# EAGLE schematic Motherboard V1.1 (EAGLE 9.6.2)

## Sheet 1 of 2
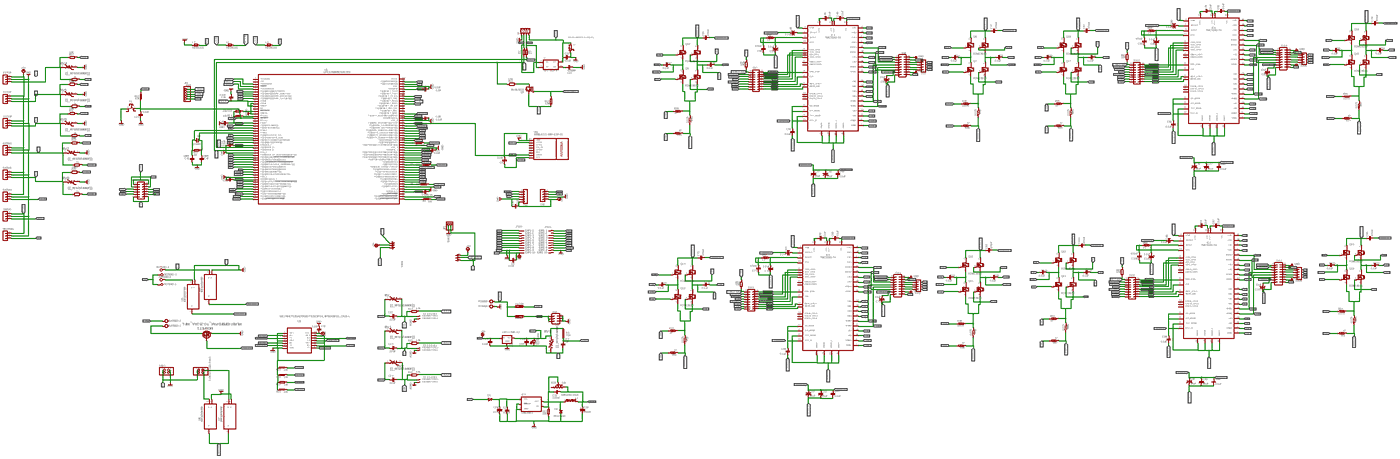
[diagram p0: schematic, sheet 1, overview]
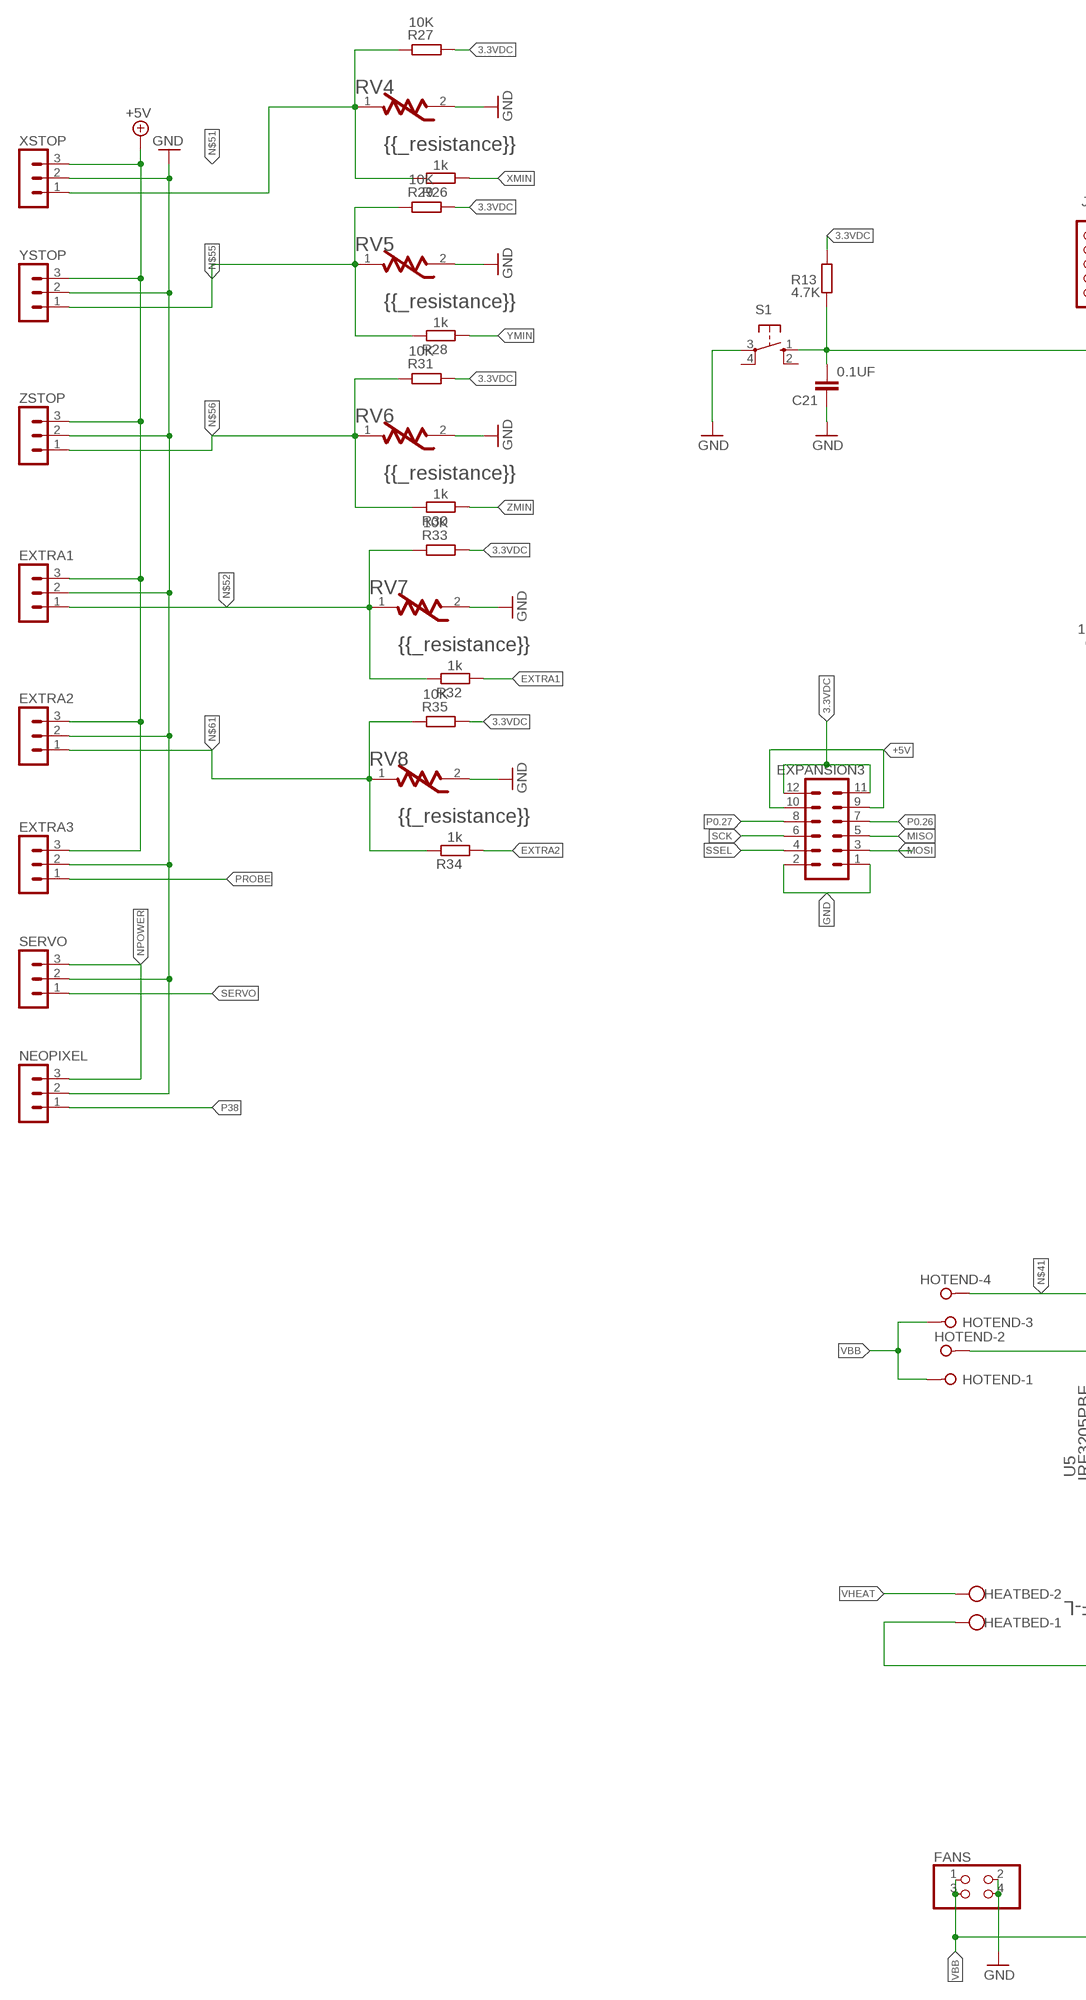
[diagram p1: schematic, sheet 1, part 1 of 4]
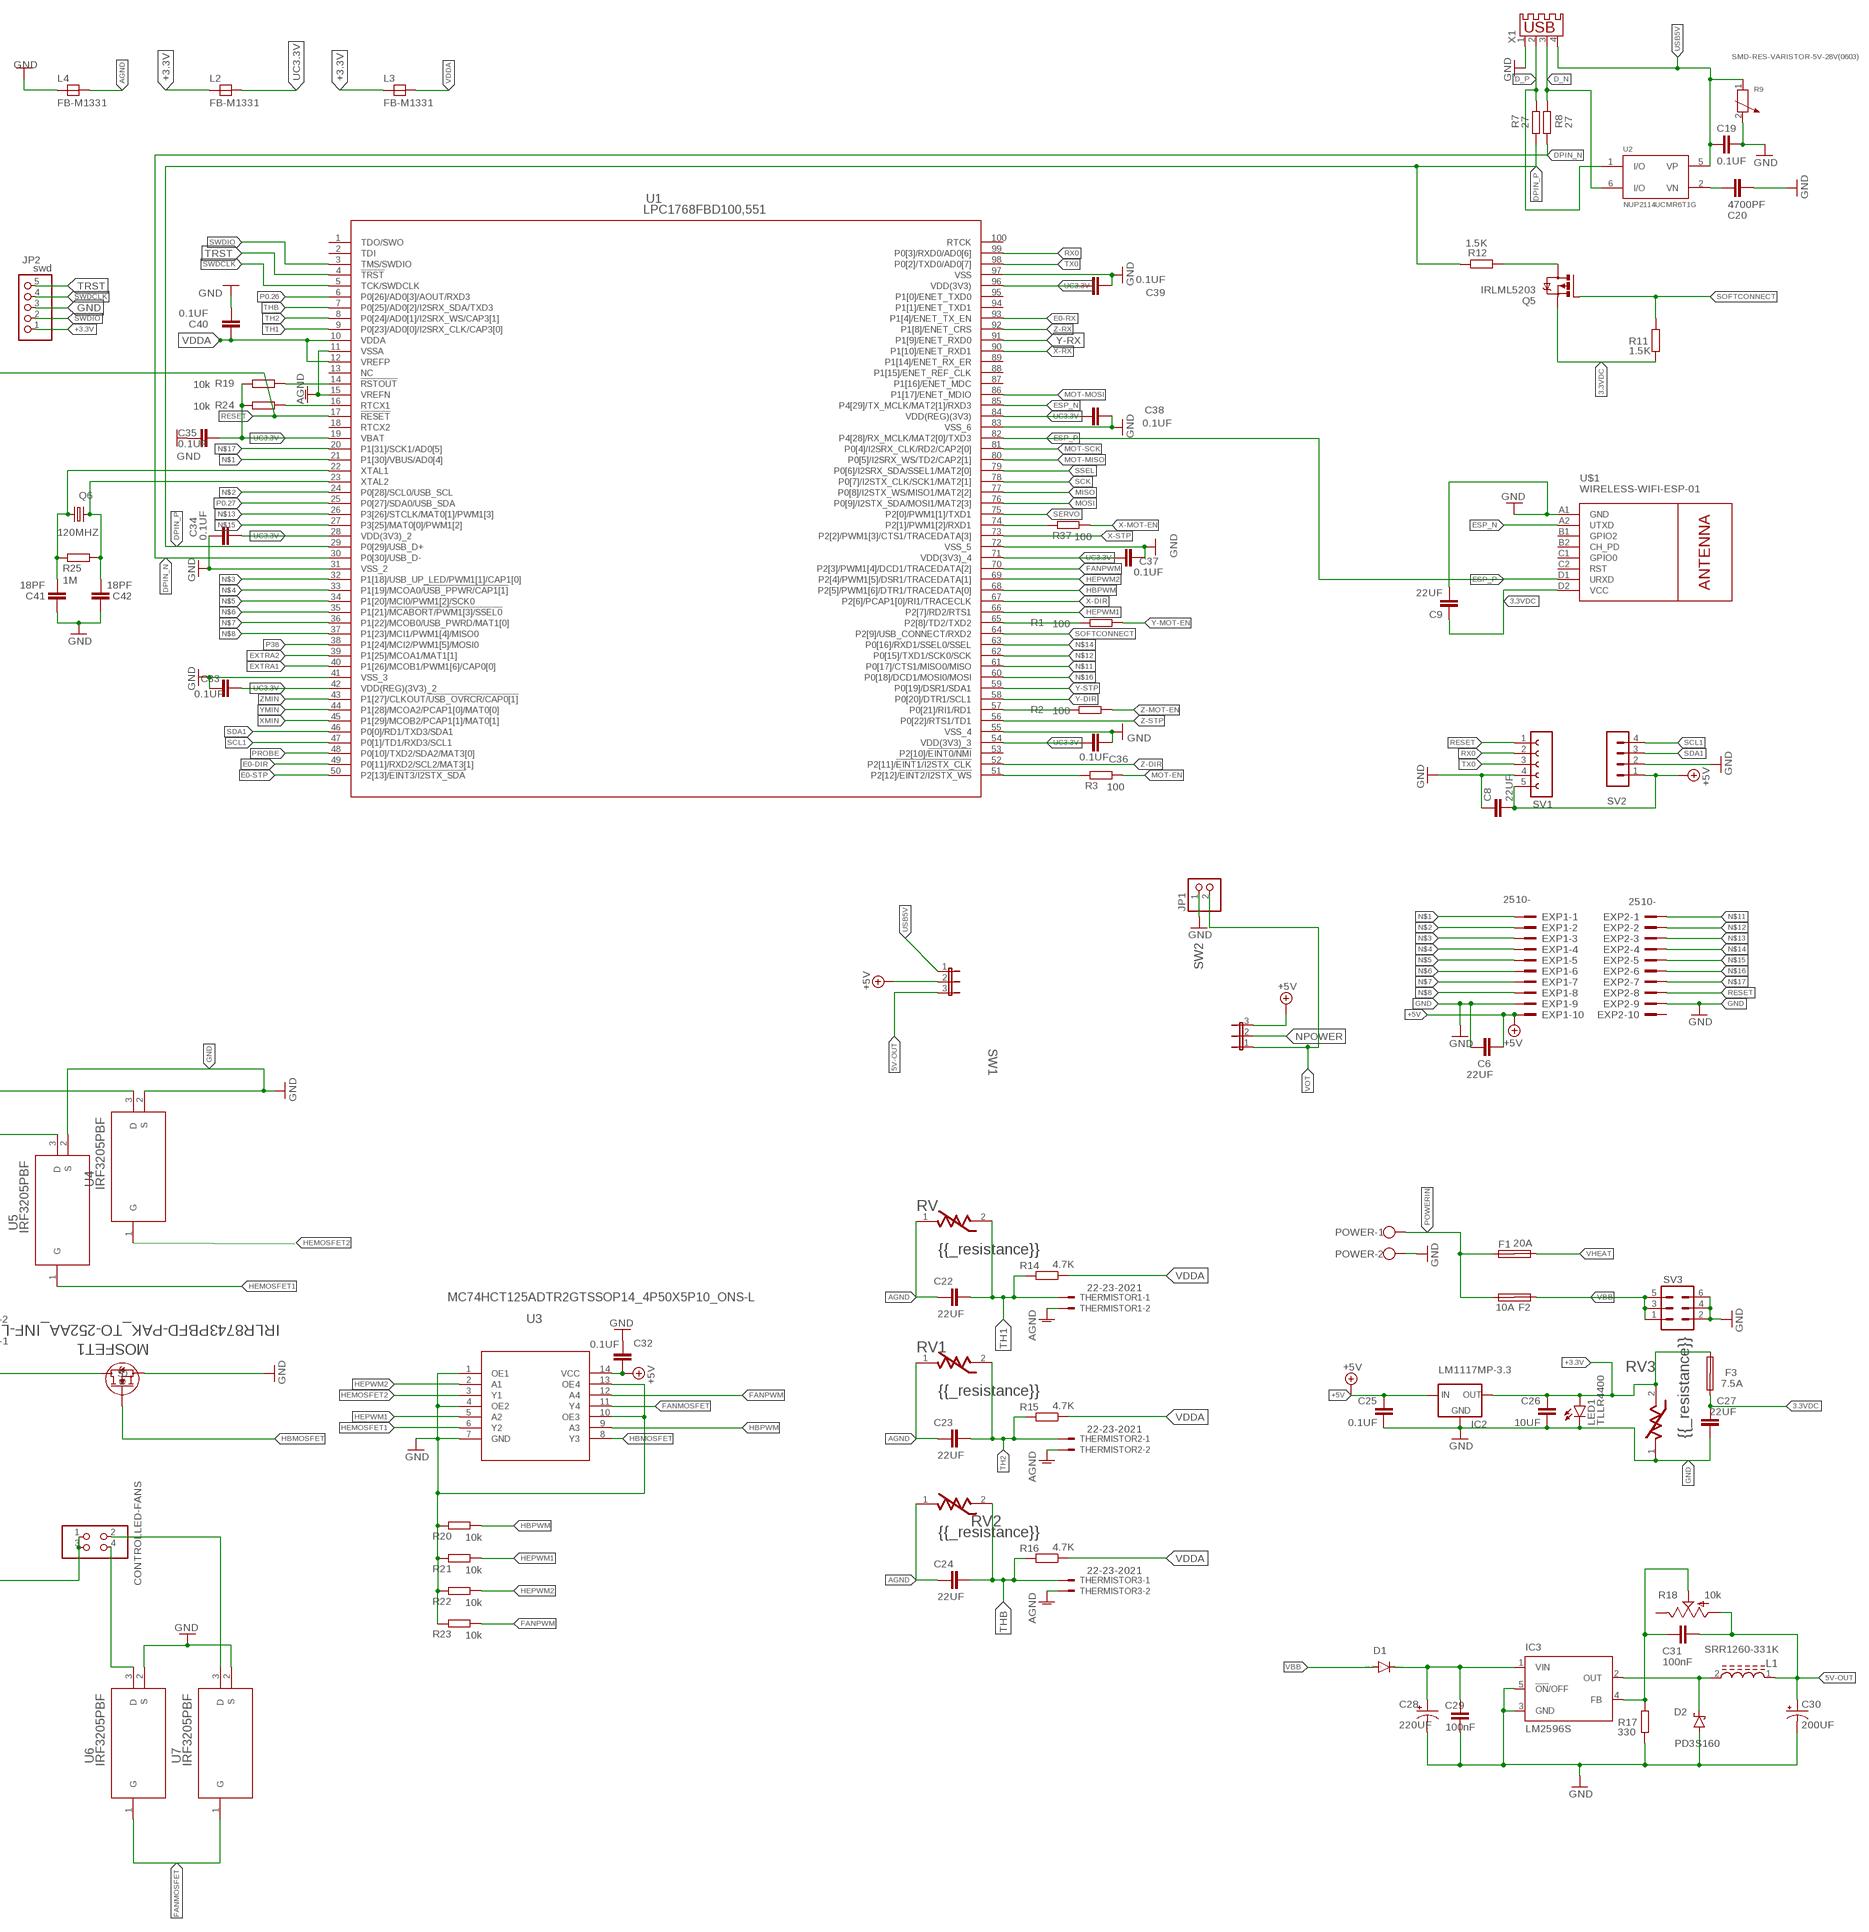
[diagram p2: schematic, sheet 1, part 2 of 4]
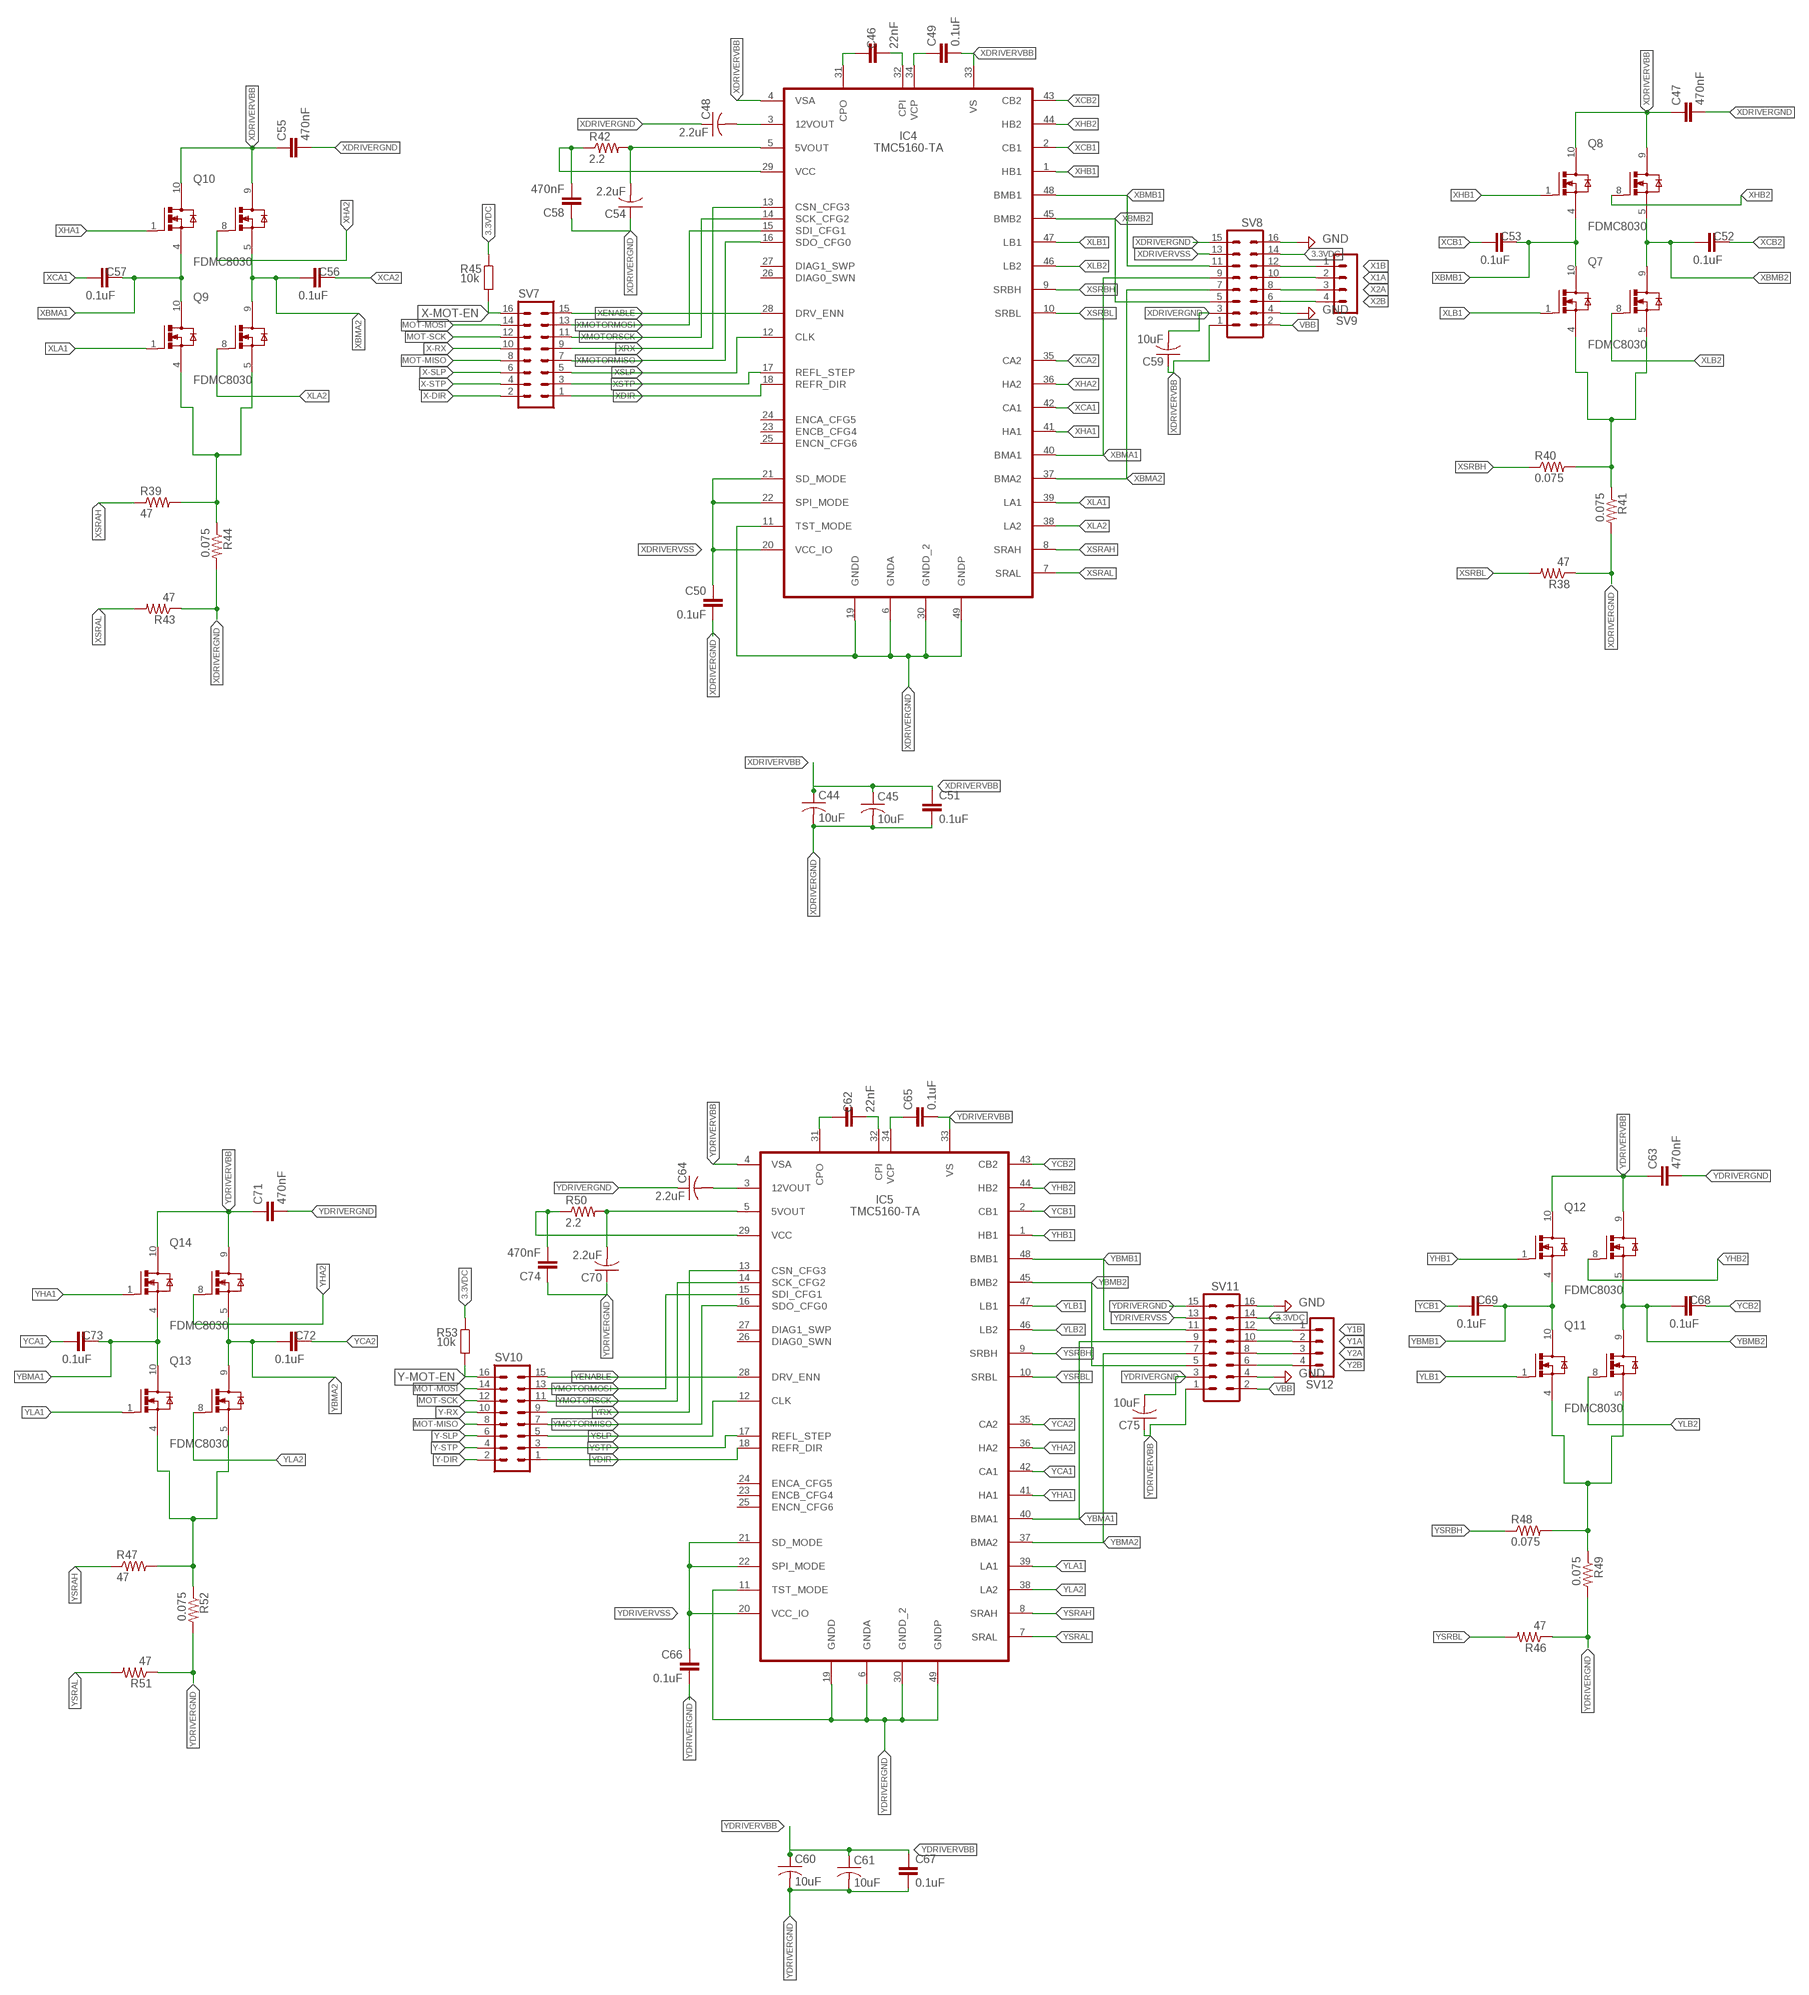
[diagram p3: schematic, sheet 1, part 3 of 4]
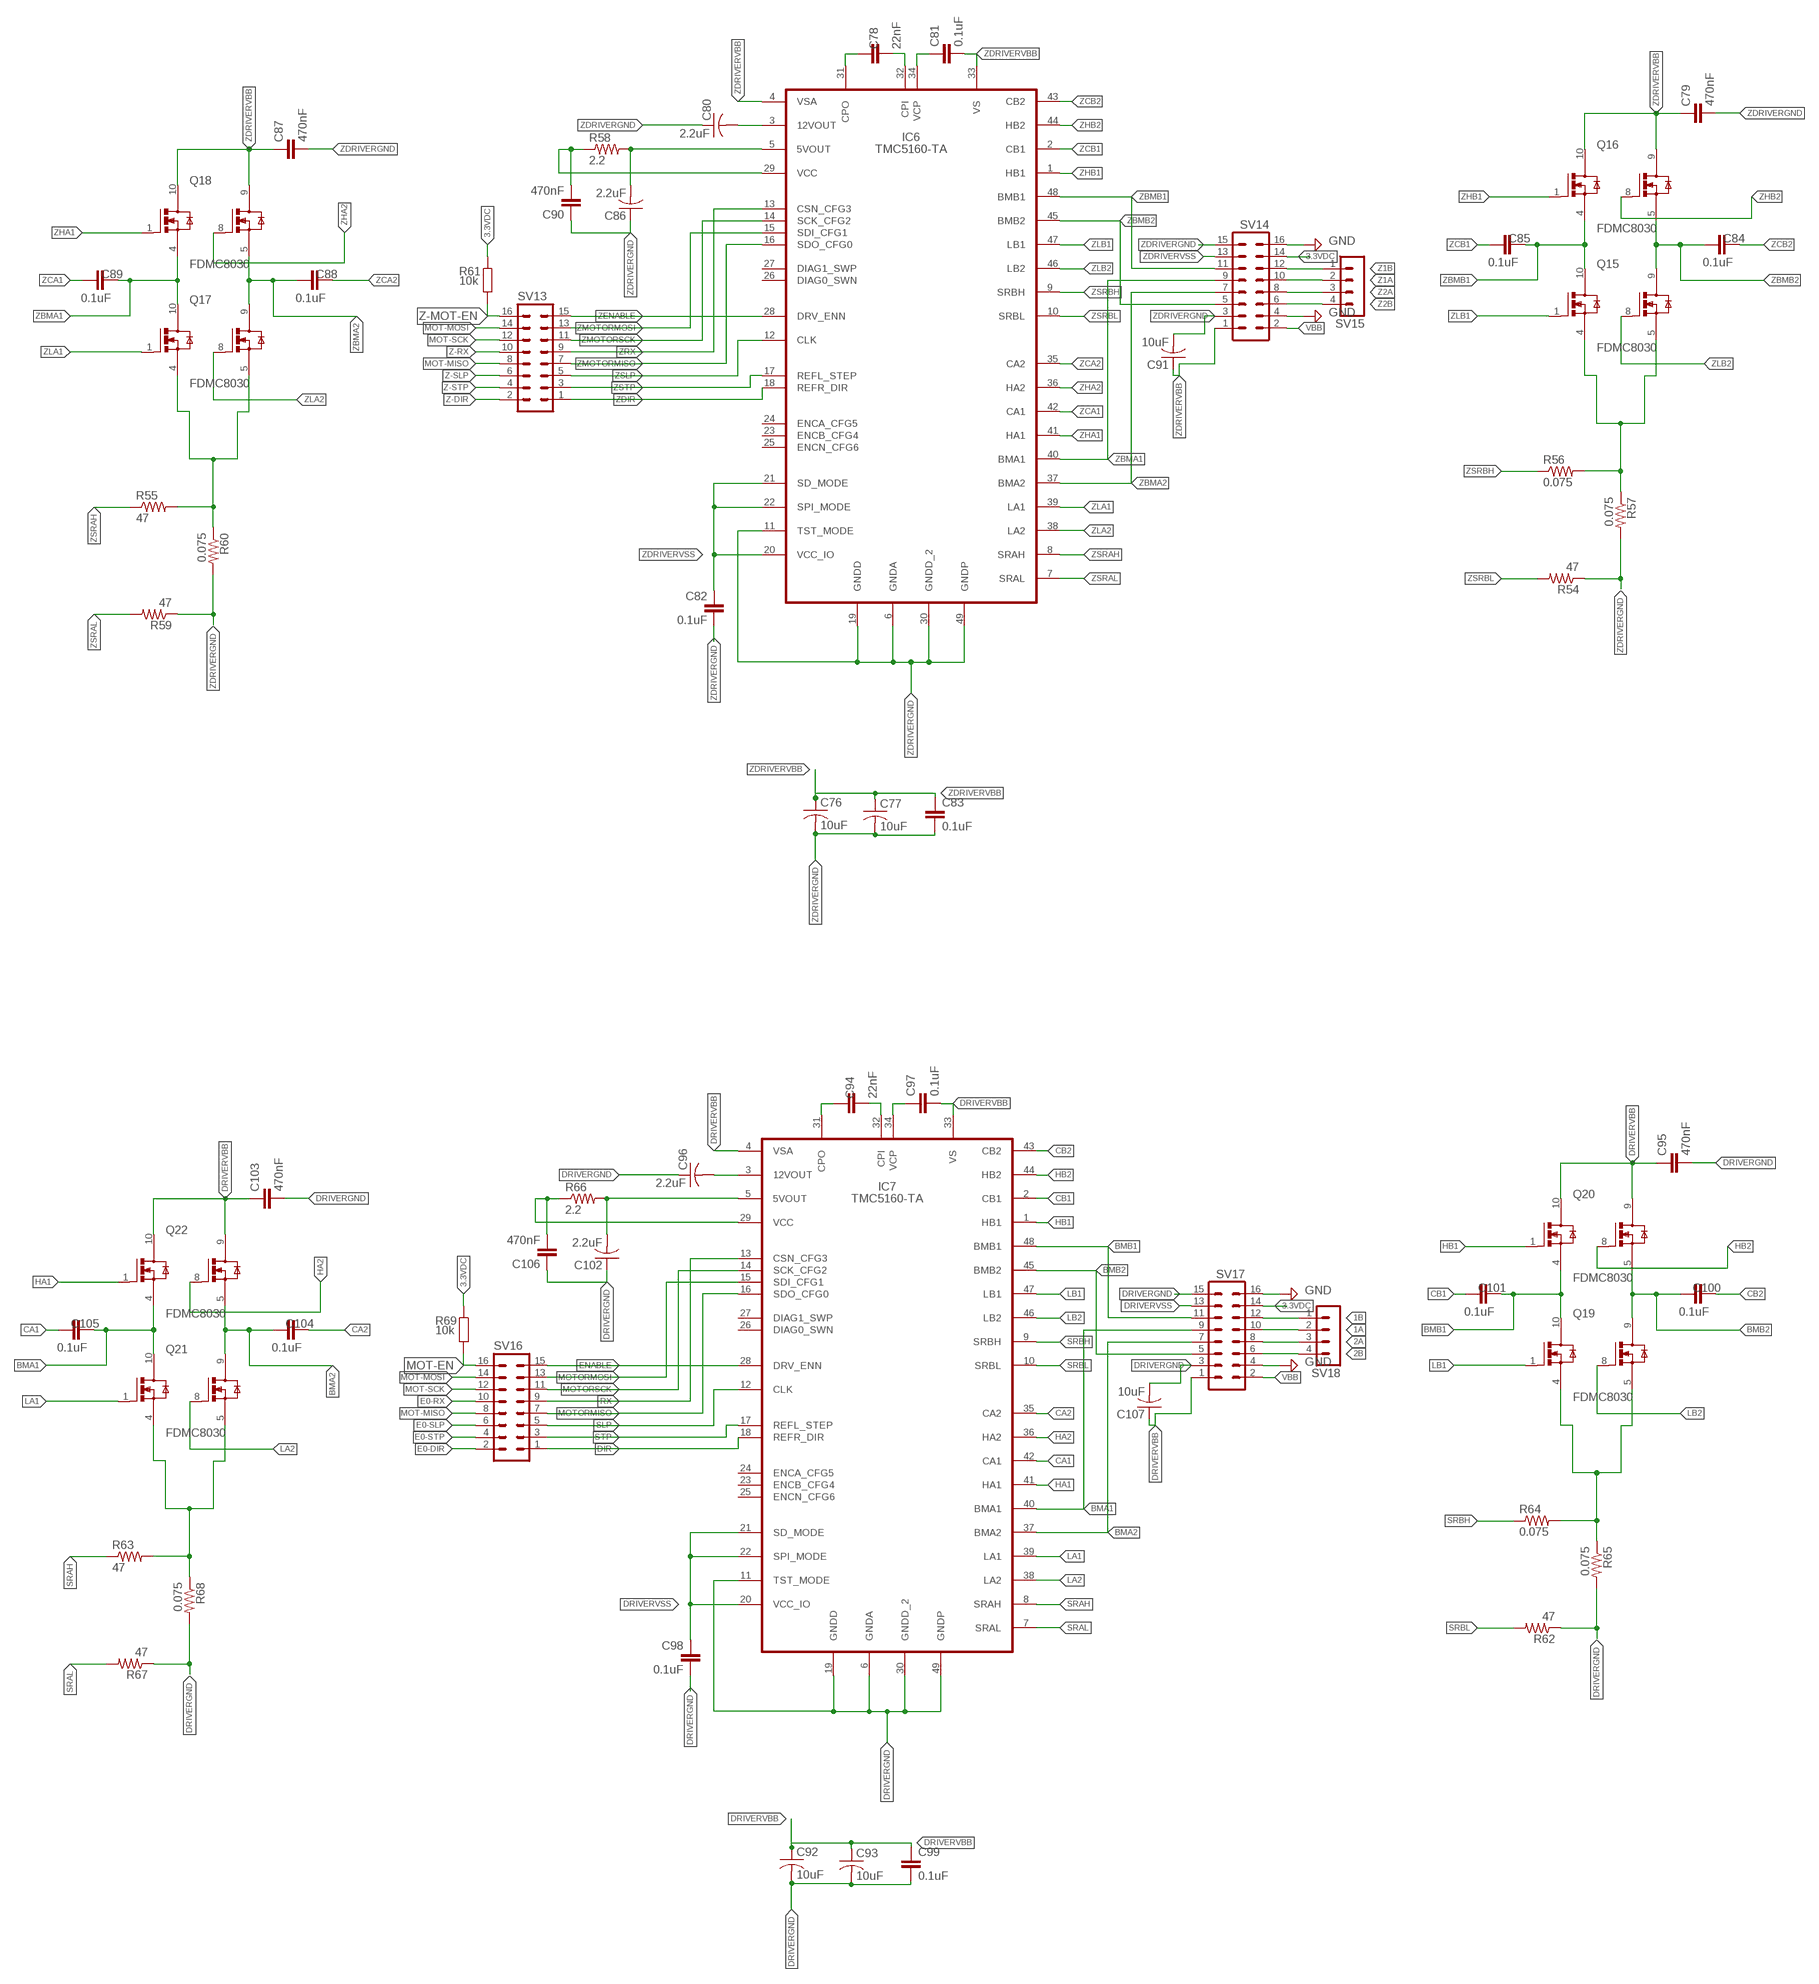
[diagram p4: schematic, sheet 1, part 4 of 4]

### Parts
C6  22UF  C-EUC0805  [C0805]
C8  22UF  C-EUC0805  [C0805]
C9  22UF  C-EUC0805  [C0805]
C19  0.1UF  C-EUC0805  [C0805]
C20  4700PF  C-EUC0805  [C0805]
C21  0.1UF  C-EUC0805  [C0805]
C22  22UF  C-EUC0805  [C0805]
C23  22UF  C-EUC0805  [C0805]
C24  22UF  C-EUC0805  [C0805]
C25  0.1UF  C-EUC0805  [C0805]
C26  10UF  C-EUC0805  [C0805]
C27  22UF  C-EUC0805  [C0805]
C28  220UF  CPOL-USE5-10.5  [E5-10,5]
C29  100nF  C-EUC0805  [C0805]
C30  200UF  CPOL-USE5-10.5  [E5-10,5]
C31  100nF  C-EUC0805  [C0805]
C32  0.1UF  C-EUC0805  [C0805]
C33  0.1UF  C-EUC0805  [C0805]
C34  0.1UF  C-EUC0805  [C0805]
C35  0.1UF  C-EUC0805  [C0805]
C36  0.1UF  C-EUC0805  [C0805]
C37  0.1UF  C-EUC0805  [C0805]
C38  0.1UF  C-EUC0805  [C0805]
C39  0.1UF  C-EUC0805  [C0805]
C40  0.1UF  C-EUC0805  [C0805]
C41  18PF  C-EUC0805  [C0805]
C42  18PF  C-EUC0805  [C0805]
C44  10uF  C-USC0805  [C0805]
C45  10uF  C-USC0805  [C0805]
C46  22nF  22NF/22,000PF-0603-50V-10%  [0603]
C47  470nF  470NF-0402-16V-10%  [0402]
C48  2.2uF  C-USC0402  [C0402]
C49  0.1uF  0.1UF-0402-16V-10%  [0402]
C50  0.1uF  0.1UF-0402-16V-10%  [0402]
C51  0.1uF  0.1UF-0402-16V-10%  [0402]
C52  0.1uF  0.1UF-0402-16V-10%  [0402]
C53  0.1uF  0.1UF-0402-16V-10%  [0402]
C54  2.2uF  C-USC0402  [C0402]
C55  470nF  470NF-0402-16V-10%  [0402]
C56  0.1uF  0.1UF-0402-16V-10%  [0402]
C57  0.1uF  0.1UF-0402-16V-10%  [0402]
C58  470nF  470NF-0402-16V-10%  [0402]
C59  10uF  C-USC0805  [C0805]
C60  10uF  C-USC0805  [C0805]
C61  10uF  C-USC0805  [C0805]
C62  22nF  22NF/22,000PF-0603-50V-10%  [0603]
C63  470nF  470NF-0402-16V-10%  [0402]
C64  2.2uF  C-USC0402  [C0402]
C65  0.1uF  0.1UF-0402-16V-10%  [0402]
C66  0.1uF  0.1UF-0402-16V-10%  [0402]
C67  0.1uF  0.1UF-0402-16V-10%  [0402]
C68  0.1uF  0.1UF-0402-16V-10%  [0402]
C69  0.1uF  0.1UF-0402-16V-10%  [0402]
C70  2.2uF  C-USC0402  [C0402]
C71  470nF  470NF-0402-16V-10%  [0402]
C72  0.1uF  0.1UF-0402-16V-10%  [0402]
C73  0.1uF  0.1UF-0402-16V-10%  [0402]
C74  470nF  470NF-0402-16V-10%  [0402]
C75  10uF  C-USC0805  [C0805]
C76  10uF  C-USC0805  [C0805]
C77  10uF  C-USC0805  [C0805]
C78  22nF  22NF/22,000PF-0603-50V-10%  [0603]
C79  470nF  470NF-0402-16V-10%  [0402]
C80  2.2uF  C-USC0402  [C0402]
C81  0.1uF  0.1UF-0402-16V-10%  [0402]
C82  0.1uF  0.1UF-0402-16V-10%  [0402]
C83  0.1uF  0.1UF-0402-16V-10%  [0402]
C84  0.1uF  0.1UF-0402-16V-10%  [0402]
C85  0.1uF  0.1UF-0402-16V-10%  [0402]
C86  2.2uF  C-USC0402  [C0402]
C87  470nF  470NF-0402-16V-10%  [0402]
C88  0.1uF  0.1UF-0402-16V-10%  [0402]
C89  0.1uF  0.1UF-0402-16V-10%  [0402]
C90  470nF  470NF-0402-16V-10%  [0402]
C91  10uF  C-USC0805  [C0805]
C92  10uF  C-USC0805  [C0805]
C93  10uF  C-USC0805  [C0805]
C94  22nF  22NF/22,000PF-0603-50V-10%  [0603]
C95  470nF  470NF-0402-16V-10%  [0402]
C96  2.2uF  C-USC0402  [C0402]
C97  0.1uF  0.1UF-0402-16V-10%  [0402]
C98  0.1uF  0.1UF-0402-16V-10%  [0402]
C99  0.1uF  0.1UF-0402-16V-10%  [0402]
C100  0.1uF  0.1UF-0402-16V-10%  [0402]
C101  0.1uF  0.1UF-0402-16V-10%  [0402]
C102  2.2uF  C-USC0402  [C0402]
C103  470nF  470NF-0402-16V-10%  [0402]
C104  0.1uF  0.1UF-0402-16V-10%  [0402]
C105  0.1uF  0.1UF-0402-16V-10%  [0402]
C106  470nF  470NF-0402-16V-10%  [0402]
C107  10uF  C-USC0805  [C0805]
CONTROLLED-FANS  PINHD-2X2  [2X02]
D1  DIODE-DO214AA  [DO214AA]
D2  PD3S160  [POWERDI323]
EXP1  2510-  [PAK100/2500-10]
EXP2  2510-  [PAK100/2500-10]
EXPANSION3  MA06-2  [MA06-2]
EXTRA1  MA03-1  [MA03-1]
EXTRA2  MA03-1  [MA03-1]
EXTRA3  MA03-1  [MA03-1]
F1  20A  SHK20Q  [SHK20Q]
F2  10A  SHK20Q  [SHK20Q]
F3  7.5A  SHK20Q  [SHK20Q]
FANS  PINHD-2X2  [2X02]
HEATBED  W237-102  [W237-102]
HOTEND  W237-04P  [W237-4P]
IC2  LM1117MP-3.3  [SOT223]
IC3  LM2596S  [TO263-5]
IC4  TMC5160-TA  [TQFP48-EP]
IC5  TMC5160-TA  [TQFP48-EP]
IC6  TMC5160-TA  [TQFP48-EP]
IC7  TMC5160-TA  [TQFP48-EP]
JP1  PINHD-1X2  [1X02]
JP2  swd  PINHD-1X5  [1X05]
L1  SRR1260-331K  [INDP125125X600N]
L2  FB-M1331  [M1331]
L3  FB-M1331  [M1331]
L4  FB-M1331  [M1331]
LED1  TLLR4400  [LED3MM]
MOSFET1  IRLR8743PBFD-PAK_TO-252AA_INF-L  [D-PAK_TO-252AA_INF-L]
NEOPIXEL  MA03-1  [MA03-1]
POWER  W237-102  [W237-102]
Q5  IRLML5203  [MICRO3]
Q6  120MHZ  CRYSTALHC49S  [HC49/S]
Q7  FDMC8030  [TRANS_FDMC8030]
Q8  FDMC8030  [TRANS_FDMC8030]
Q9  FDMC8030  [TRANS_FDMC8030]
Q10  FDMC8030  [TRANS_FDMC8030]
Q11  FDMC8030  [TRANS_FDMC8030]
Q12  FDMC8030  [TRANS_FDMC8030]
Q13  FDMC8030  [TRANS_FDMC8030]
Q14  FDMC8030  [TRANS_FDMC8030]
Q15  FDMC8030  [TRANS_FDMC8030]
Q16  FDMC8030  [TRANS_FDMC8030]
Q17  FDMC8030  [TRANS_FDMC8030]
Q18  FDMC8030  [TRANS_FDMC8030]
Q19  FDMC8030  [TRANS_FDMC8030]
Q20  FDMC8030  [TRANS_FDMC8030]
Q21  FDMC8030  [TRANS_FDMC8030]
Q22  FDMC8030  [TRANS_FDMC8030]
R1  100  R-EU_R0805  [R0805]
R2  100  R-EU_R0805  [R0805]
R3  100  R-EU_R0805  [R0805]
R7  27  R-EU_R0805  [R0805]
R8  27  R-EU_R0805  [R0805]
R9  SMD-RES-VARISTOR-5V-28V(0603)  [R0603]
R11  1.5K  R-EU_R0805  [R0805]
R12  1.5K  R-EU_R0805  [R0805]
R13  4.7K  R-EU_R0805  [R0805]
R14  4.7K  R-EU_R0805  [R0805]
R15  4.7K  R-EU_R0805  [R0805]
R16  4.7K  R-EU_R0805  [R0805]
R17  330  R-EU_R0805  [R0805]
R18  10k  TRIM_US-B64Y  [B64Y]
R19  10k  R-EU_R0805  [R0805]
R20  10k  R-EU_R0805  [R0805]
R21  10k  R-EU_R0805  [R0805]
R22  10k  R-EU_R0805  [R0805]
R23  10k  R-EU_R0805  [R0805]
R24  10k  R-EU_R0805  [R0805]
R25  1M  R-EU_R0805  [R0805]
R26  1k  R-EU_R0805  [R0805]
R27  10K  R-EU_R0805  [R0805]
R28  1k  R-EU_R0805  [R0805]
R29  10K  R-EU_R0805  [R0805]
R30  1k  R-EU_R0805  [R0805]
R31  10K  R-EU_R0805  [R0805]
R32  1k  R-EU_R0805  [R0805]
R33  10K  R-EU_R0805  [R0805]
R34  1k  R-EU_R0805  [R0805]
R35  10K  R-EU_R0805  [R0805]
R37  100  R-EU_R0805  [R0805]
R38  47  R-US_R0402  [R0402]
R39  47  R-US_R0402  [R0402]
R40  0.075  R-US_R1206  [R1206]
R41  0.075  R-US_R1206  [R1206]
R42  2.2  R-US_R0402  [R0402]
R43  47  R-US_R0402  [R0402]
R44  0.075  R-US_R1206  [R1206]
R45  10k  R-EU_R0805  [R0805]
R46  47  R-US_R0402  [R0402]
R47  47  R-US_R0402  [R0402]
R48  0.075  R-US_R1206  [R1206]
R49  0.075  R-US_R1206  [R1206]
R50  2.2  R-US_R0402  [R0402]
R51  47  R-US_R0402  [R0402]
R52  0.075  R-US_R1206  [R1206]
R53  10k  R-EU_R0805  [R0805]
R54  47  R-US_R0402  [R0402]
R55  47  R-US_R0402  [R0402]
R56  0.075  R-US_R1206  [R1206]
R57  0.075  R-US_R1206  [R1206]
R58  2.2  R-US_R0402  [R0402]
R59  47  R-US_R0402  [R0402]
R60  0.075  R-US_R1206  [R1206]
R61  10k  R-EU_R0805  [R0805]
R62  47  R-US_R0402  [R0402]
R63  47  R-US_R0402  [R0402]
R64  0.075  R-US_R1206  [R1206]
R65  0.075  R-US_R1206  [R1206]
R66  2.2  R-US_R0402  [R0402]
R67  47  R-US_R0402  [R0402]
R68  0.075  R-US_R1206  [R1206]
R69  10k  R-EU_R0805  [R0805]
RV  BOURNS_INC._CG0603MLC-3.3LEBOURNS_INC._CG0603MLC-3.3LE_0_1  [BOURNS_INC._CG0603MLC-3.3LE_1]
RV1  BOURNS_INC._CG0603MLC-3.3LEBOURNS_INC._CG0603MLC-3.3LE_0_1  [BOURNS_INC._CG0603MLC-3.3LE_1]
RV2  BOURNS_INC._CG0603MLC-3.3LEBOURNS_INC._CG0603MLC-3.3LE_0_1  [BOURNS_INC._CG0603MLC-3.3LE_1]
RV3  BOURNS_INC._CG0603MLC-3.3LEBOURNS_INC._CG0603MLC-3.3LE_0_1  [BOURNS_INC._CG0603MLC-3.3LE_1]
RV4  BOURNS_INC._CG0603MLC-3.3LEBOURNS_INC._CG0603MLC-3.3LE_0_1  [BOURNS_INC._CG0603MLC-3.3LE_1]
RV5  BOURNS_INC._CG0603MLC-3.3LEBOURNS_INC._CG0603MLC-3.3LE_0_1  [BOURNS_INC._CG0603MLC-3.3LE_1]
RV6  BOURNS_INC._CG0603MLC-3.3LEBOURNS_INC._CG0603MLC-3.3LE_0_1  [BOURNS_INC._CG0603MLC-3.3LE_1]
RV7  BOURNS_INC._CG0603MLC-3.3LEBOURNS_INC._CG0603MLC-3.3LE_0_1  [BOURNS_INC._CG0603MLC-3.3LE_1]
RV8  BOURNS_INC._CG0603MLC-3.3LEBOURNS_INC._CG0603MLC-3.3LE_0_1  [BOURNS_INC._CG0603MLC-3.3LE_1]
S1  10-XX  [B3F-10XX]
SERVO  MA03-1  [MA03-1]
SV1  FE05-1  [FE05-1]
SV2  MA04-1  [MA04-1]
SV3  MA03-2  [MA03-2]
SV7  MA08-2  [MA08-2]
SV8  MA08-2  [MA08-2]
SV9  MA04-1  [MA04-1]
SV10  MA08-2  [MA08-2]
SV11  MA08-2  [MA08-2]
SV12  MA04-1  [MA04-1]
SV13  MA08-2  [MA08-2]
SV14  MA08-2  [MA08-2]
SV15  MA04-1  [MA04-1]
SV16  MA08-2  [MA08-2]
SV17  MA08-2  [MA08-2]
SV18  MA04-1  [MA04-1]
SW1  JP2E  [JP2]
SW2  JP2E  [JP2]
THERMISTOR1  22-23-2021  [22-23-2021]
THERMISTOR2  22-23-2021  [22-23-2021]
THERMISTOR3  22-23-2021  [22-23-2021]
U1  LPC1768FBD100,551  [LQFP100_14X14_NXP]
U2  NUP2114UCMR6T1G  [SOP95P275X110-6N]
U3  MC74HCT125ADTR2GTSSOP14_4P50X5P10_ONS-L  [TSSOP14_4P50X5P10_ONS-L]
U4  IRF3205PBF  [PG-TO220-3_INF]
U5  IRF3205PBF  [PG-TO220-3_INF]
U6  IRF3205PBF  [PG-TO220-3_INF]
U7  IRF3205PBF  [PG-TO220-3_INF]
U$1  WIRELESS-WIFI-ESP-01  [WIRELESS-WIFI-ESP-01]
X1  USB-A003  [USB-A003]
XSTOP  MA03-1  [MA03-1]
YSTOP  MA03-1  [MA03-1]
ZSTOP  MA03-1  [MA03-1]

### Nets
1A: SV17.10 SV18.2
1B: SV17.12 SV18.1
2A: SV17.8 SV18.3
2B: SV17.6 SV18.4
3.3VDC: C9.1 C27.1 EXPANSION3.11 EXPANSION3.12 F3.1A Q5.2(S) R11.2 R13.1 R27.2 R29.2 R31.2 R33.2 R35.2 R45.1 R53.1 R61.1 R69.1 SV8.14 SV11.14 SV14.14 SV17.14 U$1.D2(VCC)
5V-OUT: C30.+ C31.2 L1.1 R18.A SW1.3
+3.3V: C26.1 F3.2A IC2.2(OUT) IC2.4(OUT) JP2.1 L2.1 L3.1 LED1.A RV3.2
+5V: C6.1 C8.2 C25.1 C32.2 EXP1.10 EXPANSION3.9 EXPANSION3.10 EXTRA1.3 EXTRA2.3 EXTRA3.3 IC2.3(IN) SV1.5 SV2.1 SW1.2 SW2.3 U3.14(VCC) XSTOP.3 YSTOP.3 ZSTOP.3
AGND: C22.1 C23.1 C24.1 L4.2 RV1.1 RV2.1 RV.1 THERMISTOR1.2 THERMISTOR2.2 THERMISTOR3.2 U1.11(VSSA) U1.15(VREFN)
BMA1: C105.2 IC7.40(BMA1) Q21.10(D1) Q22.4(S1) SV17.9
BMA2: C104.1 IC7.37(BMA2) Q21.9(D2) Q22.5(S2) SV17.7
BMB1: C101.2 IC7.48(BMB1) Q19.10(D1) Q20.4(S1) SV17.11
BMB2: C100.1 IC7.45(BMB2) Q19.9(D2) Q20.5(S2) SV17.5
CA1: C105.1 IC7.42(CA1)
CA2: C104.2 IC7.35(CA2)
CB1: C101.1 IC7.2(CB1)
CB2: C100.2 IC7.43(CB2)
CRYSTAL_N: C42.2 Q6.2 R25.1 U1.23(XTAL2)
CRYSTAL_P: C41.2 Q6.1 R25.2 U1.22(XTAL1)
D_N: R8.2 U2.6(I/O) X1.3
D_P: R7.2 U2.1(I/O) X1.2
DIR: IC7.18(REFR_DIR) SV16.1
DPIN_N: R8.1 U1.30(P0[30]/USB_D-)
DPIN_P: R7.1 R12.1 U1.29(P0[29]/USB_D+)
DRIVERGND: C92.2 C93.2 C95.2 C96.1 C98.2 C99.2 C102.1 C103.2 C106.1 C107.2 IC7.6(GNDA) IC7.11(TST_MODE) IC7.19(GNDD) IC7.30(GNDD_2) IC7.49(GNDP) R62.1 R65.2 R67.1 R68.2 SV17.3 SV17.15
DRIVERVBB: C92.1 C93.1 C95.1 C97.2 C99.1 C103.1 C107.1 IC7.4(VSA) IC7.33(VS) Q20.9(D2) Q20.10(D1) Q22.9(D2) Q22.10(D1) SV17.1
DRIVERVSS: C98.1 IC7.20(VCC_IO) IC7.21(SD_MODE) IC7.22(SPI_MODE) SV17.13
E0-DIR: SV16.2 U1.49(P0[11]/RXD2/SCL2/MAT3[1])
E0-RX: SV16.10 U1.93(P1[4]/ENET_TX_EN)
E0-SLP: SV16.6
E0-STP: SV16.4 U1.50(P2[13]/!EINT3/I2STX_SDA)
ENABLE: IC7.28(DRV_ENN) SV16.15
ESP_N: U1.85(P4[29]/TX_MCLK/MAT2[1]/RXD3) U$1.A2(UTXD)
ESP_P: U1.82(P4[28]/RX_MCLK/MAT2[0]/TXD3) U$1.D1(URXD)
EXTRA1: R32.2 U1.40(P1[26]/MCOB1/PWM1[6]/CAP0[0])
EXTRA2: R34.2 U1.39(P1[25]/MCOA1/MAT1[1])
FANMOSFET: U3.11(Y4) U6.1(G) U7.1(G)
FANPWM: R23.1 U1.70(P2[3]/PWM1[4]/DCD1/TRACEDATA[2]) U3.12(A4)
GND: C6.2 C8.1 C9.2 C19.1 C20.1 C21.2 C25.2 C26.2 C27.2 C28.- C29.2 C30.- C32.1 C33.1 C34.1 C35.1 C36.1 C37.1 C38.1 C39.1 C40.2 C41.1 C42.1 D2.A EXP1.9 EXP2.9 EXPANSION3.1 EXPANSION3.2 EXTRA1.2 EXTRA2.2 EXTRA3.2 FANS.2 FANS.4 IC2.1(GND) IC3.3(GND) IC3.5(!ON!/OFF) JP1.1 JP2.3 L4.1 LED1.K(C) MOSFET1.3(S) NEOPIXEL.2 POWER.2 R9.2 R17.2 R20.2 R21.2 R22.2 R23.2 RV3.1 RV4.2 RV5.2 RV6.2 RV7.2 RV8.2 S1.3(P) SERVO.2 SV1.4 SV2.2 SV3.2 SV3.4 SV3.6 SV8.4 SV8.16 SV11.4 SV11.16 SV14.4 SV14.16 SV17.4 SV17.16 U1.31(VSS_2) U1.41(VSS_3) U1.55(VSS_4) U1.72(VSS_5) U1.83(VSS_6) U1.97(VSS) U3.1(OE1) U3.4(OE2) U3.7(GND) U3.10(OE3) U3.13(OE4) U4.2(S) U5.2(S) U6.2(S) U7.2(S) U$1.A1(GND) X1.1 XSTOP.2 YSTOP.2 ZSTOP.2
HA1: IC7.41(HA1) Q22.1(G1)
HA2: IC7.36(HA2) Q22.8(G2)
HB1: IC7.1(HB1) Q20.1(G1)
HB2: IC7.44(HB2) Q20.8(G2)
HBMOSFET: MOSFET1.1(G) U3.8(Y3)
HBPWM: R20.1 U1.68(P2[5]/PWM1[6]/DTR1/TRACEDATA[0]) U3.9(A3)
HEMOSFET1: U3.6(Y2) U5.1(G)
HEMOSFET2: U3.3(Y1) U4.1(G)
HEPWM1: R21.1 U1.66(P2[7]/RD2/RTS1) U3.5(A2)
HEPWM2: R22.1 U1.69(P2[4]/PWM1[5]/DSR1/TRACEDATA[1]) U3.2(A1)
LA1: IC7.39(LA1) Q21.1(G1)
LA2: IC7.38(LA2) Q21.8(G2)
LB1: IC7.47(LB1) Q19.1(G1)
LB2: IC7.46(LB2) Q19.8(G2)
MISO: EXPANSION3.5 U1.77(P0[8]/I2STX_WS/MISO1/MAT2[2])
MOSI: EXPANSION3.3 U1.76(P0[9]/I2STX_SDA/MOSI1/MAT2[3])
MOT-EN: R3.1 R69.2 SV16.16
MOT-MISO: SV7.8 SV10.8 SV13.8 SV16.8 U1.80(P0[5]/I2SRX_WS/TD2/CAP2[1])
MOT-MOSI: SV7.14 SV10.14 SV13.14 SV16.14 U1.86(P1[17]/ENET_MDIO)
MOT-SCK: SV7.12 SV10.12 SV13.12 SV16.12 U1.81(P0[4]/I2SRX_CLK/RD2/CAP2[0])
MOTORMISO: IC7.16(SDO_CFG0) SV16.7
MOTORMOSI: IC7.15(SDI_CFG1) SV16.13
MOTORSCK: IC7.14(SCK_CFG2) SV16.11
N$1: EXP1.1 U1.21(P1[30]/VBUS/AD0[4])
N$2: EXP1.2 U1.24(P0[28]/SCL0/USB_SCL)
N$3: EXP1.3 U1.32(P1[18]/USB_UP_LED/PWM1[1]/CAP1[0])
N$4: EXP1.4 U1.33(P1[19]/MCOA0/!USB_PPWR/CAP1[1])
N$5: EXP1.5 U1.34(P1[20]/MCI0/PWM1[2]/SCK0)
N$6: EXP1.6 U1.35(P1[21]/!MCABORT/PWM1[3]/SSEL0)
N$7: EXP1.7 U1.36(P1[22]/MCOB0/USB_PWRD/MAT1[0])
N$8: EXP1.8 U1.37(P1[23]/MCI1/PWM1[4]/MISO0)
N$9: R1.2 U1.65(P2[8]/TD2/TXD2)
N$10: R2.2 U1.57(P0[21]/RI1/RD1)
N$11: EXP2.1 U1.61(P0[17]/CTS1/MISO0/MISO)
N$12: EXP2.2 U1.62(P0[15]/TXD1/SCK0/SCK)
N$13: EXP2.3 U1.26(P3[26]/STCLK/MAT0[1]/PWM1[3])
N$14: EXP2.4 U1.63(P0[16]/RXD1/SSEL0/SSEL)
N$15: EXP2.5 U1.27(P3[25]/MAT0[0]/PWM1[2])
N$16: EXP2.6 U1.60(P0[18]/DCD1/MOSI0/MOSI)
N$17: EXP2.7 U1.20(P1[31]/SCK1/AD0[5])
N$18: R3.2 U1.51(P2[12]/!EINT2/I2STX_WS)
N$22: R37.2 U1.74(P2[1]/PWM1[2]/RXD1)
N$23: C49.1 IC4.34(VCP)
N$24: C46.1 IC4.31(CPO)
N$25: C46.2 IC4.32(CPI)
N$26: C48.2 IC4.3(12VOUT)
N$27: C54.2 IC4.5(5VOUT) R42.2
N$28: C58.2 IC4.29(VCC) R42.1
N$29: Q7.4(S1) Q7.5(S2) R40.2 R41.1
N$30: Q9.4(S1) Q9.5(S2) R39.2 R44.1
N$31: C65.1 IC5.34(VCP)
N$34: C20.2 U2.2(VN)
N$35: HEATBED.1 MOSFET1.2(D)
N$36: Q5.3(D) R12.2
N$37: C31.1 IC3.4(FB) R17.1 R18.S
N$38: C28.+ C29.1 D1.C IC3.1(VIN)
N$39: D2.C IC3.2(OUT) L1.2
N$40: CONTROLLED-FANS.4 U6.3(D)
N$41: HOTEND.4 U4.3(D)
N$42: HOTEND.2 U5.3(D)
N$43: CONTROLLED-FANS.2 U7.3(D)
N$44: R19.1 U1.14(!RSTOUT)
N$45: R24.1 U1.16(RTCX1)
N$46: C62.1 IC5.31(CPO)
N$47: C62.2 IC5.32(CPI)
N$48: C64.2 IC5.3(12VOUT)
N$49: C70.2 IC5.5(5VOUT) R50.2
N$50: C74.2 IC5.29(VCC) R50.1
N$51: R26.1 R27.1 RV4.1 XSTOP.1
N$52: EXTRA1.1 R32.1 R33.1 RV7.1
N$53: Q11.4(S1) Q11.5(S2) R48.2 R49.1
N$54: Q13.4(S1) Q13.5(S2) R47.2 R52.1
N$55: R28.1 R29.1 RV5.1 YSTOP.1
N$56: R30.1 R31.1 RV6.1 ZSTOP.1
N$57: C81.1 IC6.34(VCP)
N$58: C78.1 IC6.31(CPO)
N$59: C78.2 IC6.32(CPI)
N$60: C80.2 IC6.3(12VOUT)
N$61: EXTRA2.1 R34.1 R35.1 RV8.1
N$62: C86.2 IC6.5(5VOUT) R58.2
N$63: C90.2 IC6.29(VCC) R58.1
N$64: Q15.4(S1) Q15.5(S2) R56.2 R57.1
N$65: Q17.4(S1) Q17.5(S2) R55.2 R60.1
N$66: C97.1 IC7.34(VCP)
N$67: C94.1 IC7.31(CPO)
N$68: C94.2 IC7.32(CPI)
N$69: C96.2 IC7.3(12VOUT)
N$70: C102.2 IC7.5(5VOUT) R66.2
N$71: C106.2 IC7.29(VCC) R66.1
N$72: Q19.4(S1) Q19.5(S2) R64.2 R65.1
N$73: Q21.4(S1) Q21.5(S2) R63.2 R68.1
NPOWER: NEOPIXEL.3 SERVO.3 SW2.2
P0.26: EXPANSION3.7 U1.6(P0[26]/AD0[3]/AOUT/RXD3)
P0.27: EXPANSION3.8 U1.25(P0[27]/SDA0/USB_SDA)
P38: NEOPIXEL.1 U1.38(P1[24]/MCI2/PWM1[5]/MOSI0)
POWERIN: F1.1A F2.2A POWER.1
PROBE: EXTRA3.1 U1.48(P0[10]/TXD2/SDA2/MAT3[0])
RESET: C21.1 EXP2.8 R13.2 S1.1(S) SV1.1 U1.17(!RESET)
RX: IC7.13(CSN_CFG3) SV16.9
RX0: SV1.2 U1.99(P0[3]/RXD0/AD0[6])
SCK: EXPANSION3.6 U1.78(P0[7]/I2STX_CLK/SCK1/MAT2[1])
SCL1: SV2.4 U1.47(P0[1]/TD1/RXD3/SCL1)
SDA1: SV2.3 U1.46(P0[0]/RD1/TXD3/SDA1)
SERVO: SERVO.1 U1.75(P2[0]/PWM1[1]/TXD1)
SLP: IC7.12(CLK) SV16.5
SOFTCONNECT: Q5.1(G) R11.1 U1.64(P2[9]/USB_CONNECT/RXD2)
SRAH: IC7.8(SRAH) R63.1
SRAL: IC7.7(SRAL) R67.2
SRBH: IC7.9(SRBH) R64.1
SRBL: IC7.10(SRBL) R62.2
SSEL: EXPANSION3.4 U1.79(P0[6]/I2SRX_SDA/SSEL1/MAT2[0])
STP: IC7.17(REFL_STEP) SV16.3
SWDCLK: JP2.4 U1.5(TCK/SWDCLK)
SWDIO: JP2.2 U1.3(TMS/SWDIO)
TH1: C22.2 R14.2 RV.2 THERMISTOR1.1 U1.9(P0[23]/AD0[0]/I2SRX_CLK/CAP3[0])
TH2: C23.2 R15.2 RV1.2 THERMISTOR2.1 U1.8(P0[24]/AD0[1]/I2SRX_WS/CAP3[1])
THB: C24.2 R16.2 RV2.2 THERMISTOR3.1 U1.7(P0[25]/AD0[2]/I2SRX_SDA/TXD3)
TRST: JP2.5 U1.4(!TRST)
TX0: SV1.3 U1.98(P0[2]/TXD0/AD0[7])
UC3.3V: C33.2 C34.2 C35.2 C36.2 C37.2 C38.2 C39.2 L2.2 R19.2 R24.2 U1.19(VBAT) U1.28(VDD(3V3)_2) U1.42(VDD(REG)(3V3)_2) U1.54(VDD(3V3)_3) U1.71(VDD(3V3)_4) U1.84(VDD(REG)(3V3)) U1.96(VDD(3V3))
USB5V: C19.2 R9.1 SW1.1 U2.5(VP) X1.4
VBB: CONTROLLED-FANS.1 CONTROLLED-FANS.3 D1.A F2.1A FANS.1 FANS.3 HOTEND.1 HOTEND.3 SV3.1 SV3.3 SV3.5 SV8.2 SV11.2 SV14.2 SV17.2
VDDA: C40.1 L3.2 R14.1 R15.1 R16.1 U1.10(VDDA) U1.12(VREFP)
VHEAT: F1.2A HEATBED.2
VOT: JP1.2 SW2.1
X1A: SV8.10 SV9.2
X1B: SV8.12 SV9.1
X2A: SV8.8 SV9.3
X2B: SV8.6 SV9.4
X-DIR: SV7.2 U1.67(P2[6]/PCAP1[0]/RI1/TRACECLK)
X-MOT-EN: R37.1 R45.2 SV7.16
X-RX: SV7.10 U1.90(P1[10]/ENET_RXD1)
X-SLP: SV7.6
X-STP: SV7.4 U1.73(P2[2]/PWM1[3]/CTS1/TRACEDATA[3])
XBMA1: C57.2 IC4.40(BMA1) Q9.10(D1) Q10.4(S1) SV8.9
XBMA2: C56.1 IC4.37(BMA2) Q9.9(D2) Q10.5(S2) SV8.7
XBMB1: C53.2 IC4.48(BMB1) Q7.10(D1) Q8.4(S1) SV8.11
XBMB2: C52.1 IC4.45(BMB2) Q7.9(D2) Q8.5(S2) SV8.5
XCA1: C57.1 IC4.42(CA1)
XCA2: C56.2 IC4.35(CA2)
XCB1: C53.1 IC4.2(CB1)
XCB2: C52.2 IC4.43(CB2)
XDIR: IC4.18(REFR_DIR) SV7.1
XDRIVERGND: C44.2 C45.2 C47.2 C48.1 C50.2 C51.2 C54.1 C55.2 C58.1 C59.2 IC4.6(GNDA) IC4.11(TST_MODE) IC4.19(GNDD) IC4.30(GNDD_2) IC4.49(GNDP) R38.1 R41.2 R43.1 R44.2 SV8.3 SV8.15
XDRIVERVBB: C44.1 C45.1 C47.1 C49.2 C51.1 C55.1 C59.1 IC4.4(VSA) IC4.33(VS) Q8.9(D2) Q8.10(D1) Q10.9(D2) Q10.10(D1) SV8.1
XDRIVERVSS: C50.1 IC4.20(VCC_IO) IC4.21(SD_MODE) IC4.22(SPI_MODE) SV8.13
XENABLE: IC4.28(DRV_ENN) SV7.15
XHA1: IC4.41(HA1) Q10.1(G1)
XHA2: IC4.36(HA2) Q10.8(G2)
XHB1: IC4.1(HB1) Q8.1(G1)
XHB2: IC4.44(HB2) Q8.8(G2)
XLA1: IC4.39(LA1) Q9.1(G1)
XLA2: IC4.38(LA2) Q9.8(G2)
XLB1: IC4.47(LB1) Q7.1(G1)
XLB2: IC4.46(LB2) Q7.8(G2)
XMIN: R26.2 U1.45(P1[29]/MCOB2/PCAP1[1]/MAT0[1])
XMOTORMISO: IC4.16(SDO_CFG0) SV7.7
XMOTORMOSI: IC4.15(SDI_CFG1) SV7.13
XMOTORSCK: IC4.14(SCK_CFG2) SV7.11
XRX: IC4.13(CSN_CFG3) SV7.9
XSLP: IC4.12(CLK) SV7.5
XSRAH: IC4.8(SRAH) R39.1
XSRAL: IC4.7(SRAL) R43.2
XSRBH: IC4.9(SRBH) R40.1
XSRBL: IC4.10(SRBL) R38.2
XSTP: IC4.17(REFL_STEP) SV7.3
Y1A: SV11.10 SV12.2
Y1B: SV11.12 SV12.1
Y2A: SV11.8 SV12.3
Y2B: SV11.6 SV12.4
Y-DIR: SV10.2 U1.58(P0[20]/DTR1/SCL1)
Y-MOT-EN: R1.1 R53.2 SV10.16
Y-RX: SV10.10 U1.91(P1[9]/ENET_RXD0)
Y-SLP: SV10.6
Y-STP: SV10.4 U1.59(P0[19]/DSR1/SDA1)
YBMA1: C73.2 IC5.40(BMA1) Q13.10(D1) Q14.4(S1) SV11.9
YBMA2: C72.1 IC5.37(BMA2) Q13.9(D2) Q14.5(S2) SV11.7
YBMB1: C69.2 IC5.48(BMB1) Q11.10(D1) Q12.4(S1) SV11.11
YBMB2: C68.1 IC5.45(BMB2) Q11.9(D2) Q12.5(S2) SV11.5
YCA1: C73.1 IC5.42(CA1)
YCA2: C72.2 IC5.35(CA2)
YCB1: C69.1 IC5.2(CB1)
YCB2: C68.2 IC5.43(CB2)
YDIR: IC5.18(REFR_DIR) SV10.1
YDRIVERGND: C60.2 C61.2 C63.2 C64.1 C66.2 C67.2 C70.1 C71.2 C74.1 C75.2 IC5.6(GNDA) IC5.11(TST_MODE) IC5.19(GNDD) IC5.30(GNDD_2) IC5.49(GNDP) R46.1 R49.2 R51.1 R52.2 SV11.3 SV11.15
YDRIVERVBB: C60.1 C61.1 C63.1 C65.2 C67.1 C71.1 C75.1 IC5.4(VSA) IC5.33(VS) Q12.9(D2) Q12.10(D1) Q14.9(D2) Q14.10(D1) SV11.1
YDRIVERVSS: C66.1 IC5.20(VCC_IO) IC5.21(SD_MODE) IC5.22(SPI_MODE) SV11.13
YENABLE: IC5.28(DRV_ENN) SV10.15
YHA1: IC5.41(HA1) Q14.1(G1)
YHA2: IC5.36(HA2) Q14.8(G2)
YHB1: IC5.1(HB1) Q12.1(G1)
YHB2: IC5.44(HB2) Q12.8(G2)
YLA1: IC5.39(LA1) Q13.1(G1)
YLA2: IC5.38(LA2) Q13.8(G2)
YLB1: IC5.47(LB1) Q11.1(G1)
YLB2: IC5.46(LB2) Q11.8(G2)
YMIN: R28.2 U1.44(P1[28]/MCOA2/PCAP1[0]/MAT0[0])
YMOTORMISO: IC5.16(SDO_CFG0) SV10.7
YMOTORMOSI: IC5.15(SDI_CFG1) SV10.13
YMOTORSCK: IC5.14(SCK_CFG2) SV10.11
YRX: IC5.13(CSN_CFG3) SV10.9
YSLP: IC5.12(CLK) SV10.5
YSRAH: IC5.8(SRAH) R47.1
YSRAL: IC5.7(SRAL) R51.2
YSRBH: IC5.9(SRBH) R48.1
YSRBL: IC5.10(SRBL) R46.2
YSTP: IC5.17(REFL_STEP) SV10.3
Z1A: SV14.10 SV15.2
Z1B: SV14.12 SV15.1
Z2A: SV14.8 SV15.3
Z2B: SV14.6 SV15.4
Z-DIR: SV13.2 U1.52(P2[11]/!EINT1/I2STX_CLK)
Z-MOT-EN: R2.1 R61.2 SV13.16
Z-RX: SV13.10 U1.92(P1[8]/ENET_CRS)
Z-SLP: SV13.6
Z-STP: SV13.4 U1.56(P0[22]/RTS1/TD1)
ZBMA1: C89.2 IC6.40(BMA1) Q17.10(D1) Q18.4(S1) SV14.9
ZBMA2: C88.1 IC6.37(BMA2) Q17.9(D2) Q18.5(S2) SV14.7
ZBMB1: C85.2 IC6.48(BMB1) Q15.10(D1) Q16.4(S1) SV14.11
ZBMB2: C84.1 IC6.45(BMB2) Q15.9(D2) Q16.5(S2) SV14.5
ZCA1: C89.1 IC6.42(CA1)
ZCA2: C88.2 IC6.35(CA2)
ZCB1: C85.1 IC6.2(CB1)
ZCB2: C84.2 IC6.43(CB2)
ZDIR: IC6.18(REFR_DIR) SV13.1
ZDRIVERGND: C76.2 C77.2 C79.2 C80.1 C82.2 C83.2 C86.1 C87.2 C90.1 C91.2 IC6.6(GNDA) IC6.11(TST_MODE) IC6.19(GNDD) IC6.30(GNDD_2) IC6.49(GNDP) R54.1 R57.2 R59.1 R60.2 SV14.3 SV14.15
ZDRIVERVBB: C76.1 C77.1 C79.1 C81.2 C83.1 C87.1 C91.1 IC6.4(VSA) IC6.33(VS) Q16.9(D2) Q16.10(D1) Q18.9(D2) Q18.10(D1) SV14.1
ZDRIVERVSS: C82.1 IC6.20(VCC_IO) IC6.21(SD_MODE) IC6.22(SPI_MODE) SV14.13
ZENABLE: IC6.28(DRV_ENN) SV13.15
ZHA1: IC6.41(HA1) Q18.1(G1)
ZHA2: IC6.36(HA2) Q18.8(G2)
ZHB1: IC6.1(HB1) Q16.1(G1)
ZHB2: IC6.44(HB2) Q16.8(G2)
ZLA1: IC6.39(LA1) Q17.1(G1)
ZLA2: IC6.38(LA2) Q17.8(G2)
ZLB1: IC6.47(LB1) Q15.1(G1)
ZLB2: IC6.46(LB2) Q15.8(G2)
ZMIN: R30.2 U1.43(P1[27]/CLKOUT/!USB_OVRCR/CAP0[1])
ZMOTORMISO: IC6.16(SDO_CFG0) SV13.7
ZMOTORMOSI: IC6.15(SDI_CFG1) SV13.13
ZMOTORSCK: IC6.14(SCK_CFG2) SV13.11
ZRX: IC6.13(CSN_CFG3) SV13.9
ZSLP: IC6.12(CLK) SV13.5
ZSRAH: IC6.8(SRAH) R55.1
ZSRAL: IC6.7(SRAL) R59.2
ZSRBH: IC6.9(SRBH) R56.1
ZSRBL: IC6.10(SRBL) R54.2
ZSTP: IC6.17(REFL_STEP) SV13.3
Unconnected: EXP2.10 F1.1B F1.2B F2.1B F2.2B F3.1B F3.2B IC4.23(ENCB_CFG4) IC4.24(ENCA_CFG5) IC4.25(ENCN_CFG6) IC4.26(DIAG0_SWN) IC4.27(DIAG1_SWP) IC5.23(ENCB_CFG4) IC5.24(ENCA_CFG5) IC5.25(ENCN_CFG6) IC5.26(DIAG0_SWN) IC5.27(DIAG1_SWP) IC6.23(ENCB_CFG4) IC6.24(ENCA_CFG5) IC6.25(ENCN_CFG6) IC6.26(DIAG0_SWN) IC6.27(DIAG1_SWP) IC7.23(ENCB_CFG4) IC7.24(ENCA_CFG5) IC7.25(ENCN_CFG6) IC7.26(DIAG0_SWN) IC7.27(DIAG1_SWP) R18.E S1.2(S1) S1.4(P1) U1.1(TDO/SWO) U1.2(TDI) U1.13(NC) U1.18(RTCX2) U1.53(P2[10]/!EINT0/NMI) U1.87(P1[16]/ENET_MDC) U1.88(P1[15]/ENET_REF_CLK) U1.89(P1[14]/ENET_RX_ER) U1.94(P1[1]/ENET_TXD1) U1.95(P1[0]/ENET_TXD0) U1.100(RTCK) U$1.B1(GPIO2) U$1.B2(CH_PD) U$1.C1(GPIO0) U$1.C2(RST)

## Sheet 2 of 2

## Library data of the parts
C6 C8 C9 C19-C27 C29 C31-C42 = rcl:C-EU: CAPACITOR, European symbol; SPICEPREFIX: C
C28 C30 = rcl:CPOL-US: POLARIZED CAPACITOR, American symbol; SPICEPREFIX: C
C44 C45 C48 C54 C59-C61 C64 C70 C75-C77 C80 C86 C91-C93 C96 C102 C107 = adafruit:C-US: CAPACITOR, American symbol
C46 C62 C78 C94 = SparkFun-Capacitors:22NF/22,000PF: 0.022uF/22nF/22,000pF ceramic capacitors A capacitor is a passive two-terminal electrical component used to store electrical energy temporarily in an electric field.; PROD_ID: CAP-07885
C47 C55 C58 C63 C71 C74 C79 C87 C90 C95 C103 C106 = SparkFun-Capacitors:470NF: 0.47uF/470nF ceramic capacitors A capacitor is a passive two-terminal electrical component used to store electrical energy temporarily in an electric field.; PROD_ID: CAP-09041
C49-C53 C56 C57 C65-C69 C72 C73 C81-C85 C88 C89 C97-C101 C104 C105 = SparkFun-Capacitors:0.1UF: 0.1µF ceramic capacitors A capacitor is a passive two-terminal electrical component used to store electrical energy temporarily in an electric field.; PROD_ID: CAP-12416
CONTROLLED-FANS FANS = pinhead:PINHD-2X2: PIN HEADER
D1 = diode:DIODE-: DIODE
D2 = diode:PD3S160: 1.0A SURFACE MOUNT SCHOTTKY BARRIER RECTIFIER POWERDI ® 323 Source: http://www.diodes.com/datasheets/ds30899.pdf
EXP1 EXP2 = con-3m:2510-: 3M (TM) Pak 100 4-Wall Header Source: 3M; MF: 3M; MPN: 2510-6002UB; OC_FARNELL: 9838244; OC_NEWARK: 46F4725
EXPANSION3 = con-lstb:MA06-2: PIN HEADER; OC_FARNELL: unknown; OC_NEWARK: unknown
EXTRA1-EXTRA3 NEOPIXEL SERVO XSTOP YSTOP ZSTOP = con-lstb:MA03-1: PIN HEADER; OC_FARNELL: unknown; OC_NEWARK: unknown
F1-F3 = fuse:SHK20Q: FUSE HOLDER 5 x 20 mm, SH contact, E1207 Buerklin 64G6061; OC_FARNELL: unknown; OC_NEWARK: unknown
HEATBED POWER = con-wago-500:W237-102: WAGO SCREW CLAMP; MPN: 237-102; OC_FARNELL: unknown; OC_NEWARK: 70K9898
HOTEND = con-wago-508:W237-04P: WAGO SREW CLAMP; OC_FARNELL: unknown; OC_NEWARK: unknown
IC2 = lm1117_10:LM1117?-*: 800mA Low-Dropout Linear Regulator Source: http://www.ti.com/lit/ds/symlink/lm1117-n.pdf; MF: Texas Instruments; MPN: LM1117MP-3.3; OC_FARNELL: 9778195; OC_NEWARK: 28X3416
IC3 = national-semiconductor:LM2596: SIMPLE SWITCHER® Power Converter 150 kHz 3A Step-Down Voltage Regulator Source: http://www.national.com/ds/LM/LM2596.pdf; MF: NATIONAL SEMICONDUCTOR; MPN: LM2596S-ADJ/NOPB; OC_FARNELL: 9494367; OC_NEWARK: 41K3842
IC4-IC7 = TMC5160-TA:TMC5160-TA: Universal high voltage controller for two-phase bipolar stepper motor. TQFP48-EP; AVAILABILITY: Unavailable; DESCRIPTION: Bipolar Motor Driver BCD MOS External Power MOSFETs SPI, Step/Direction 48-TQFP-EP _7x7_; MF: Trinamic Motion; MP: TMC5160-TA; PACKAGE: TQFP-48 Trinamic Motion; PRICE: None
JP1 = pinhead:PINHD-1X2: PIN HEADER
JP2 = pinhead:PINHD-1X5: PIN HEADER
L1 = SRR1260-331K:SRR1260-331K: Inductor Power Shielded Wirewound 33uH 20% 100KHz 27Q-Factor Ferrite 3A 60mOhm DCR T/R Buy Part <https://snapeda.com/parts/SRR1260-331K/Bourns/view-part/?ref=eda>; AVAILABILITY: Good; DESCRIPTION: 330µH Shielded Wirewound Inductor 1.15A 580mOhm Max Nonstandard; DIGIKEY-PURCHASE-URL: https://snapeda.com/shop?store=DigiKey&id=317881; MF: Bourns; MOUSER-PURCHASE-URL: https://snapeda.com/shop?store=Mouser&id=317881; MP: SRR1260-331K; PACKAGE: Nonstandard Bourns; PRICE: None
L2-L4 = inductors-jwmiller:FB: FERRITE BEAD
LED1 = led:TLLR4400: Low Current (2mA) LED 3 mm Tinted Diffused Package color RED Source: Data sheet <http://www.farnell.com/datasheets/391100.pdf>; MF: VISHAY SEMICONDUCTOR; OC_FARNELL: 1612437
MOSFET1 = IRLR8743:IRLR8743PBF; BUILT_BY: EMA_Cory; COPYRIGHT: Copyright (C) 2018 Accelerated Designs. All rights reserved; DATASHEET: https://www.infineon.com/dgdl/irlr8743pbf.pdf?fileId=5546d462533600a4015356719c7e26ff; MANUFACTURER_PART_NUMBER: IRLR8743PBF; SOURCELIBRARY: Infineon_2020-07-22; VENDOR: Infineon
Q5 = transistor-power:IRLML5203: HEXFET P-Channel Power MOSFET
Q6 = crystal:CRYSTAL: CRYSTAL; OC_FARNELL: 1667008; OC_NEWARK: unknown
Q7-Q22 = FDMC8030:FDMC8030: Dual N-Channel Power Trench® MOSFET 40 V, 12 A, 10 mΩ; AVAILABILITY: Unavailable; DESCRIPTION: Mosfet Array 2 N-Channel _Dual_ 40V 12A 800mW Surface Mount 8-Power33 _3x3_; MF: ON Semiconductor; MP: FDMC8030; PACKAGE: PowerWDFN-8 ON Semiconductor; PRICE: None
R1-R3 R7 R8 R11-R17 R19-R35 R37 R45 R53 R61 R69 = rcl:R-EU_: RESISTOR, European symbol; SPICEPREFIX: R
R9 = SMD-RES-VARISTOR-5V-28V_0603_:SMD-RES-VARISTOR-5V-28V(0603): 314130003; DESCRIPTION: Varistor 1 Circuit Surface Mount, MLCV 0603 (1608 Metric); DIGI-KEY_PART_NUMBER: CG0603MLC-05ECT-ND; DIGIKEY-PURCHASE-URL: https://snapeda.com/shop?store=DigiKey&id=43960; MF: Bourns; MOUSER-PURCHASE-URL: https://snapeda.com/shop?store=Mouser&id=43960; MP: CG0603MLC-05E; PACKAGE: 0603 Bourns
R18 = pot:TRIM_US-: POTENTIOMETER
R38-R44 R46-R52 R54-R60 R62-R68 = adafruit:R-US_: RESISTOR, American symbol
RV RV1-RV8 = Bourns Inc. - CG0603MLC-3.3LE:BOURNS_INC._CG0603MLC-3.3LE: Varistor 1 Circuit Surface Mount, MLCV 0603 (1608 Metric); AUTOMOTIVE: No; CAPACITANCE: 0.5pF; CENTROID_NOT_SPECIFIED: No; CLAMPING_VOLTAGE: 25V; DATASHEET: https://www.bourns.com/docs/Product-Datasheets/MLC.pdf; DEVICE_CLASS_L1: Circuit Protection; DEVICE_CLASS_L2: Varistors; DEVICE_CLASS_L3: unset; DIGIKEY_DESCRIPTION: RES VARISTOR 0603; DIGIKEY_PART_NUMBER: CG0603MLC-3.3LECT-ND; ESD_PROTEC_PRESENT: true; FOOTPRINT_PARAMETERS_1: {"fp_type":"chip_res","params":{"L":{"nom":1600000,"long name":"Length","min":1400000,"max":1800000,"short name":"L","type":"measurement"},"W":{"nom":800000,"long name":"Width","min":600000,"max":1000000,"short name":"W","type":"measurement"},"t":{"nom":450000,"long name":"Height","min":350000,"max":550000,"short name":"t","type":"measurement"},"b":{"nom":300000,"long name":"Terminal width","min":99999,"max":500000,"short name":"b","type":"measurement"},"P":{"default":"false","long name":"Polarized","type":"multichoice","short name":"P"},"offset x":{"nom":0,"long name":"X Center offset","min":null,"max":null,"short name":"offset x","type":"measurement"},"offset y":{"nom":0,"long name":"Y Center offset","min":null,"max":null,"short name":"offset y","type":"measurement"},"LS":{"long name":"Land shape","type":"fixed","short name":"LS","value":"Rectangle"},"solder toe":{"nom":550000,"long name":"Solder fillet (toe)","min":null,"max":null,"short name":"solder toe","type":"fixedmeasurement"},"solder heel":{"nom":0,"long name":"Solder fillet (heel)","min":null,"max":null,"short name":"solder heel","type":"fixedmeasurement"},"solder side":{"nom":50000,"long name":"Solder fillet (side)","min":null,"max":null,"short name":"solder side","type":"fixedmeasurement"},"courtyard":{"nom":500000,"long name":"Courtyard","min":null,"max":null,"short name":"courtyard","type":"fixedmeasurement"},"SF":{"default":"A (>= 1608 metric)","long name":"Packing level","type":"multichoiceparent","short name":"SF","help":"http://support.upverter.com/customer/portal/articles/978783-what-is-a-footprint-packing-level","children":["solder toe","solder heel","solder side","courtyard"]}}}; FOOTPRINT_PARAMETERS_2: {"fp_type":"chip_res","params":{"L":{"nom":1600000,"long name":"Length","min":1400000,"max":1800000,"short name":"L","type":"measurement"},"W":{"nom":800000,"long name":"Width","min":600000,"max":1000000,"short name":"W","type":"measurement"},"t":{"nom":450000,"long name":"Height","min":350000,"max":550000,"short name":"t","type":"measurement"},"b":{"nom":300000,"long name":"Terminal width","min":99999,"max":500000,"short name":"b","type":"measurement"},"P":{"default":"false","long name":"Polarized","type":"multichoice","short name":"P"},"offset x":{"nom":0,"long name":"X Center offset","min":null,"max":null,"short name":"offset x","type":"measurement"},"offset y":{"nom":0,"long name":"Y Center offset","min":null,"max":null,"short name":"offset y","type":"measurement"},"LS":{"long name":"Land shape","type":"fixed","short name":"LS","value":"Rectangle"},"solder toe":{"nom":350000,"long name":"Solder fillet (toe)","min":null,"max":null,"short name":"solder toe","type":"fixedmeasurement"},"solder heel":{"nom":0,"long name":"Solder fillet (heel)","min":null,"max":null,"short name":"solder heel","type":"fixedmeasurement"},"solder side":{"nom":0,"long name":"Solder fillet (side)","min":null,"max":null,"short name":"solder side","type":"fixedmeasurement"},"courtyard":{"nom":250000,"long name":"Courtyard","min":null,"max":null,"short name":"courtyard","type":"fixedmeasurement"},"SF":{"default":"B (>= 1608 metric)","long name":"Packing level","type":"multichoiceparent","short name":"SF","help":"http://support.upverter.com/customer/portal/articles/978783-what-is-a-footprint-packing-level","children":["solder toe","solder heel","solder side","courtyard"]}}}; FOOTPRINT_PARAMETERS_3: {"fp_type":"chip_res","params":{"L":{"nom":1600000,"long name":"Length","min":1400000,"max":1800000,"short name":"L","type":"measurement"},"W":{"nom":800000,"long name":"Width","min":600000,"max":1000000,"short name":"W","type":"measurement"},"t":{"nom":450000,"long name":"Height","min":350000,"max":550000,"short name":"t","type":"measurement"},"b":{"nom":300000,"long name":"Terminal width","min":99999,"max":500000,"short name":"b","type":"measurement"},"P":{"default":"false","long name":"Polarized","type":"multichoice","short name":"P"},"offset x":{"nom":0,"long name":"X Center offset","min":null,"max":null,"short name":"offset x","type":"measurement"},"offset y":{"nom":0,"long name":"Y Center offset","min":null,"max":null,"short name":"offset y","type":"measurement"},"LS":{"long name":"Land shape","type":"fixed","short name":"LS","value":"Rectangle"},"solder toe":{"nom":150000,"long name":"Solder fillet (toe)","min":null,"max":null,"short name":"solder toe","type":"fixedmeasurement"},"solder heel":{"nom":0,"long name":"Solder fillet (heel)","min":null,"max":null,"short name":"solder heel","type":"fixedmeasurement"},"solder side":{"nom":-50000,"long name":"Solder fillet (side)","min":null,"max":null,"short name":"solder side","type":"fixedmeasurement"},"courtyard":{"nom":100000,"long name":"Courtyard","min":null,"max":null,"short name":"courtyard","type":"fixedmeasurement"},"SF":{"default":"C (>= 1608 metric)","long name":"Packing level","type":"multichoiceparent","short name":"SF","help":"http://support.upverter.com/customer/portal/articles/978783-what-is-a-footprint-packing-level","children":["solder toe","solder heel","solder side","courtyard"]}}}; FOOTPRINT_VARIANT_NAME_0: Recommended_Land_Pattern; FOOTPRINT_VARIANT_NAME_1: IPC_A; FOOTPRINT_VARIANT_NAME_2: IPC_B; FOOTPRINT_VARIANT_NAME_3: IPC_C; HEIGHT: 0.55mm; IPC_LAND_PATTERN_NAME: RESC16080X45; LEAD_FREE: Yes; MF: Bourns Inc.; MFG_PACKAGE_IDENT: CG0603MLC; MFG_PACKAGE_IDENT_COMPONENT_ID: 6f7aec650cdc1335; MFG_PACKAGE_IDENT_DATE: 0; MFG_PACKAGE_IDENT_REV: 0; MOUSER_DESCRIPTION: ESD Suppressor Multilayer Varistor 3.3V 2-Pin Case 0603(1608Metric) T/R; MOUSER_PART_NUMBER: 652-CG0603MLC-3.3LE; MPN: CG0603MLC-3.3LE; PACKAGE: 0603; PREFIX: R; ROHS: Yes; TEMPERATURE_RANGE_HIGH: +85°C; TEMPERATURE_RANGE_LOW: -40°C; VERIFICATION_VERSION: 0.0.0.3; VOLTAGE_RATING_DC: 3.3V
S1 = switch-omron:10-XX: OMRON SWITCH; MPN: B3F-1000; OC_FARNELL: 176432; OC_NEWARK: 36M3542
SV1 = con-lsta:FE05-1: FEMALE HEADER; OC_FARNELL: unknown; OC_NEWARK: unknown
SV2 SV9 SV12 SV15 SV18 = con-lstb:MA04-1: PIN HEADER; OC_FARNELL: unknown; OC_NEWARK: unknown
SV3 = con-lstb:MA03-2: PIN HEADER; OC_FARNELL: unknown; OC_NEWARK: unknown
SV7 SV8 SV10 SV11 SV13 SV14 SV16 SV17 = con-lstb:MA08-2: PIN HEADER; OC_FARNELL: unknown; OC_NEWARK: unknown
SW1 SW2 = jumper:JP2E: JUMPER
THERMISTOR1-THERMISTOR3 = con-molex:22-23-2021: .100" (2.54mm) Center Header - 2 Pin; MF: MOLEX; MPN: 22-23-2021; OC_FARNELL: 1462926; OC_NEWARK: 25C3832
U1 = LPC1768:LPC1768FBD100,551; BUILT_BY: EMA_Jessica; COPYRIGHT: Copyright (C) 2016 Accelerated Designs. All rights reserved; MANUFACTURER_PART_NUMBER: LPC1768FBD100,551; SOURCELIBRARY: NXP_2018-12-15; VENDOR: NXP
U2 = NUP2114UCMR6T1G:NUP2114UCMR6T1G: Uni Directional 10 V SMD ESD Protection Transient Voltage Suppressor - TSOP-6; DESCRIPTION: 10V (Typ) Clamp 8A (8/20µs) Ipp Tvs Diode Surface Mount 6-TSOP; DIGI-KEY_PART_NUMBER: NUP2114UCMR6T1GOSCT-ND; MF: ON Semiconductor; MP: NUP2114UCMR6T1G; PACKAGE: TSOP-6 ON Semiconductor
U3 = TriStateBuffer:MC74HCT125ADTR2G; COPYRIGHT: Copyright (C) 2016 Accelerated Designs. All rights reserved; MANUFACTURER_PART_NUMBER: MC74HCT125ADTR2G; SOURCELIBRARY: ONSemi_2017-12-12_5; VENDOR: ON Semiconductor
U4-U7 = IRF3205PBF:IRF3205PBF; BUILT_BY: EMA_UL_Team; COPYRIGHT: Copyright (C) 2018 Accelerated Designs. All rights reserved; MANUFACTURER_PART_NUMBER: IRF3205PBF; SOURCELIBRARY: Infineon_2019-12-20; VENDOR: Infineon
U$1 = ESP:WIRELESS-WIFI-ESP-01: Wireless Wi-Fi ESP-01 Module based on ESP8266 chip Click here to find device on ebay.com <http://www.ebay.com/sch/esp8266+esp+01+transceiver>
X1 = con-yamaichi:USB-A003: USB connector; OC_FARNELL: unknown; OC_NEWARK: unknown